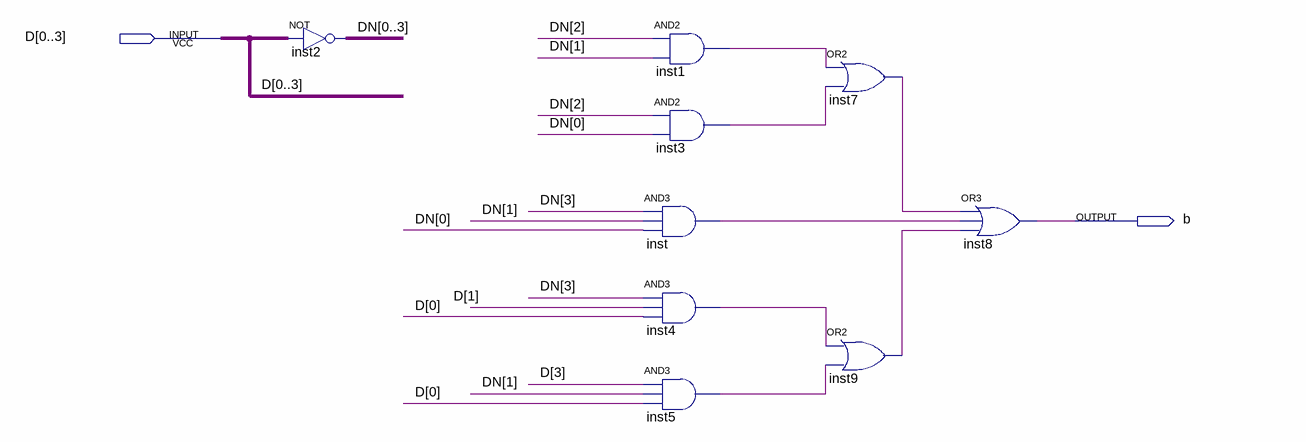
[diagram p0: schematic sheet]
// Quartus schematic d1.bdf as structural Verilog: 9 symbols, 2 pins
module d1 (
  input  [0:3] D,
  output b
);

  wire inst1_out, inst3_out, inst4_out, inst5_out, inst7_out, inst9_out, inst_out;
  wire [3:0] DN;

  assign {DN[0], DN[1], DN[2], DN[3]} = ~D;  // NOT inst2, 4 bits wide
  and inst1 (inst1_out, DN[2], DN[1]);
  and inst3 (inst3_out, DN[2], DN[0]);
  and inst (inst_out, DN[3], DN[1], DN[0]);
  and inst4 (inst4_out, DN[3], D[1], D[0]);
  and inst5 (inst5_out, D[3], DN[1], D[0]);
  or inst7 (inst7_out, inst1_out, inst3_out);
  or inst9 (inst9_out, inst4_out, inst5_out);
  or inst8 (b, inst7_out, inst_out, inst9_out);
endmodule
